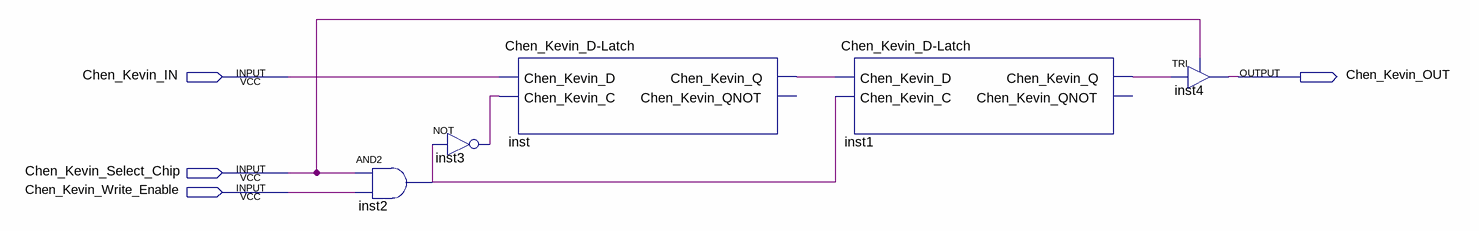
[diagram p0: schematic sheet]
// Quartus schematic Chen_Kevin_SRAM.bdf as structural Verilog: 5 symbols, 4 pins
module Chen_Kevin_SRAM (
  input  Chen_Kevin_IN,
  input  Chen_Kevin_Select_Chip,
  input  Chen_Kevin_Write_Enable,
  output Chen_Kevin_OUT
);

  wire inst1_chen_kevin_q, inst2_out, inst3_out, inst_chen_kevin_q;

  and inst2 (inst2_out, Chen_Kevin_Select_Chip, Chen_Kevin_Write_Enable);
  not inst3 (inst3_out, inst2_out);
  \Chen_Kevin_D-Latch  inst (
    .Chen_Kevin_D(Chen_Kevin_IN), .Chen_Kevin_C(inst3_out), .Chen_Kevin_Q(inst_chen_kevin_q));  // open: Chen_Kevin_QNOT
  \Chen_Kevin_D-Latch  inst1 (
    .Chen_Kevin_D(inst_chen_kevin_q), .Chen_Kevin_C(inst2_out), .Chen_Kevin_Q(inst1_chen_kevin_q));  // open: Chen_Kevin_QNOT
  TRI inst4 (.IN(inst1_chen_kevin_q), .OE(Chen_Kevin_Select_Chip), .OUT(Chen_Kevin_OUT));
endmodule
